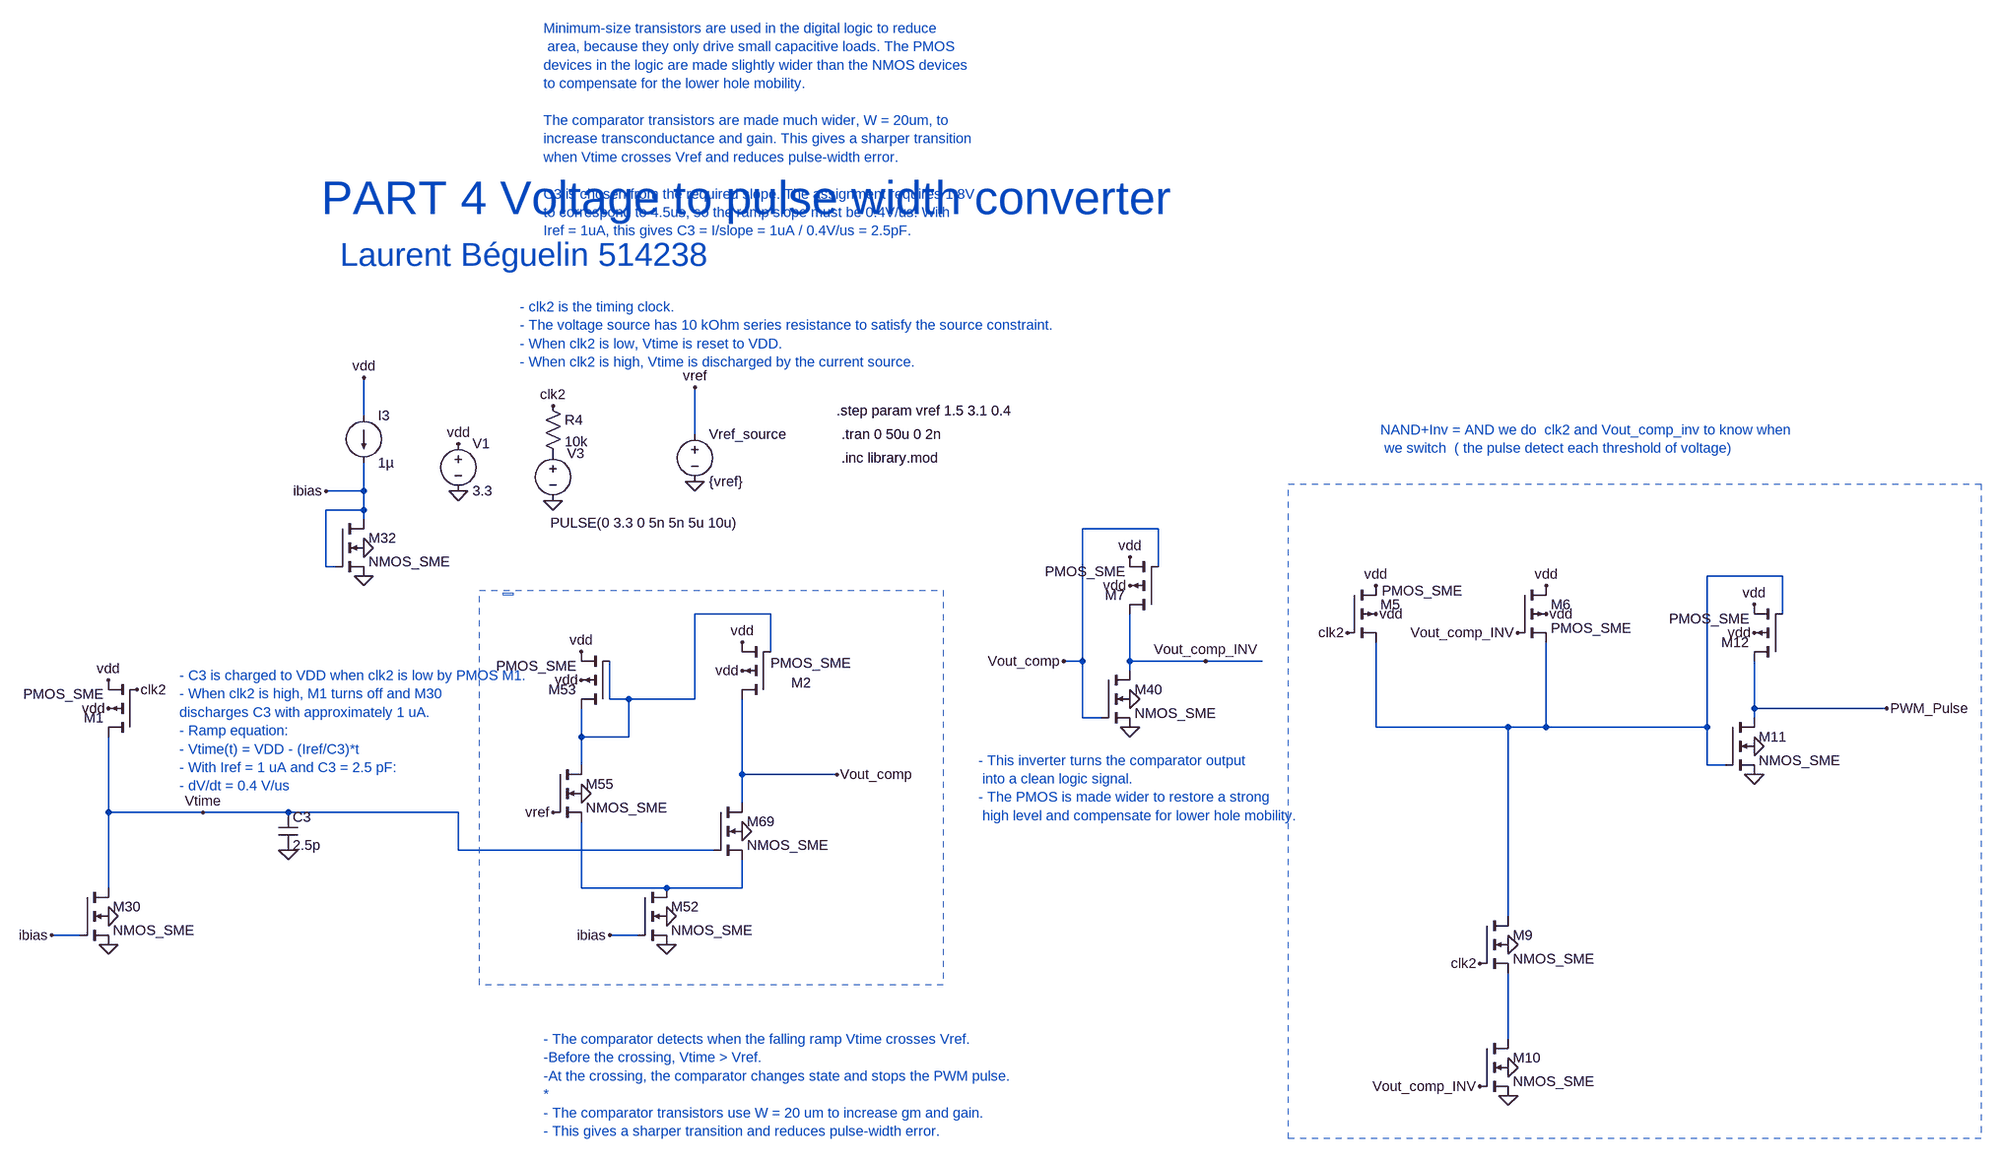
[diagram p0: schematic CMOS_Project_part4.asc]
CMOS_Project_part4.asc, the LTspice schematic file:
Version 4
SHEET 1 9192 1488
WIRE 5584 -624 5584 -688
WIRE 6144 -592 6144 -672
WIRE 5584 -496 5584 -544
WIRE 5584 -496 5520 -496
WIRE 5584 -464 5584 -496
WIRE 5584 -464 5520 -464
WIRE 5584 -448 5584 -464
WIRE 6928 -432 6800 -432
WIRE 5520 -368 5520 -464
WIRE 5536 -368 5520 -368
WIRE 6928 -368 6928 -432
WIRE 7984 -352 7856 -352
WIRE 6272 -288 6144 -288
WIRE 7984 -288 7984 -352
WIRE 6272 -224 6272 -288
WIRE 6800 -208 6800 -432
WIRE 6800 -208 6768 -208
WIRE 6880 -208 6880 -288
WIRE 7008 -208 6880 -208
WIRE 7104 -208 7008 -208
WIRE 6880 -192 6880 -208
WIRE 6000 -144 6000 -208
WIRE 6032 -144 6000 -144
WIRE 6144 -144 6144 -288
WIRE 6144 -144 6032 -144
WIRE 7936 -128 7936 -208
WIRE 8160 -128 7936 -128
WIRE 6800 -112 6800 -208
WIRE 6832 -112 6800 -112
WIRE 7936 -112 7936 -128
WIRE 7296 -96 7296 -240
WIRE 7520 -96 7296 -96
WIRE 7584 -96 7584 -240
WIRE 7584 -96 7520 -96
WIRE 7856 -96 7856 -352
WIRE 7856 -96 7584 -96
WIRE 5952 -80 5952 -128
WIRE 6032 -80 6032 -144
WIRE 6032 -80 5952 -80
WIRE 5952 -32 5952 -80
WIRE 7856 -32 7856 -96
WIRE 7888 -32 7856 -32
WIRE 6224 -16 6224 -144
WIRE 6384 -16 6224 -16
WIRE 6224 32 6224 -16
WIRE 5152 48 5152 -80
WIRE 5312 48 5152 48
WIRE 5456 48 5312 48
WIRE 5744 48 5456 48
WIRE 5744 112 5744 48
WIRE 6176 112 5744 112
WIRE 5152 176 5152 48
WIRE 5952 176 5952 64
WIRE 6096 176 5952 176
WIRE 6224 176 6224 128
WIRE 6224 176 6096 176
WIRE 7520 224 7520 -96
WIRE 5104 256 5056 256
WIRE 6048 256 6000 256
WIRE 7520 432 7520 320
FLAG 5744 -496 0
FLAG 5744 -576 vdd
FLAG 5904 -480 0
FLAG 5904 -640 clk2
FLAG 5312 48 Vtime
FLAG 5152 272 0
FLAG 5152 224 0
FLAG 5056 256 ibias
FLAG 5584 -352 0
FLAG 5584 -400 0
FLAG 5520 -496 ibias
FLAG 5584 -688 vdd
FLAG 6144 -512 0
FLAG 6144 -672 vref
FLAG 6880 -96 0
FLAG 6880 -144 0
FLAG 6096 272 0
FLAG 6096 224 0
FLAG 6000 256 ibias
FLAG 5952 -176 vdd
FLAG 5952 -224 vdd
FLAG 5952 16 0
FLAG 6224 80 0
FLAG 6384 -16 Vout_comp
FLAG 6768 -208 Vout_comp
FLAG 5456 112 0
FLAG 5152 -128 vdd
FLAG 5152 -176 vdd
FLAG 5200 -160 clk2
FLAG 6224 -192 vdd
FLAG 6224 -240 vdd
FLAG 5904 48 vref
FLAG 7008 -208 Vout_comp_INV
FLAG 6880 -384 vdd
FLAG 6880 -336 vdd
FLAG 7520 272 0
FLAG 7520 528 0
FLAG 7520 480 0
FLAG 7472 304 clk2
FLAG 7936 -16 0
FLAG 7936 -64 0
FLAG 7936 -304 vdd
FLAG 7936 -256 vdd
FLAG 8160 -128 PWM_Pulse
FLAG 7472 512 Vout_comp_INV
FLAG 7248 -256 clk2
FLAG 7536 -256 Vout_comp_INV
FLAG 7296 -288 vdd
FLAG 7584 -288 vdd
FLAG 7584 -336 vdd
FLAG 7296 -336 vdd
SYMBOL voltage 5744 -592 R0
WINDOW 123 0 0 Left 0
WINDOW 39 0 0 Left 0
SYMATTR InstName V1
SYMATTR Value 3.3
SYMBOL voltage 5904 -576 R0
WINDOW 123 0 0 Left 0
WINDOW 39 0 0 Left 0
WINDOW 3 -4 134 Left 2
SYMATTR Value PULSE(0 3.3 0 5n 5n 5u 10u)
SYMATTR InstName V3
SYMBOL Res 5888 -656 R0
SYMATTR InstName R4
SYMATTR Value 10k
SYMBOL Cap 5440 48 R0
SYMATTR InstName C3
SYMATTR Value 2.5p
SYMBOL nmos4 5104 176 R0
SYMATTR InstName M30
SYMATTR Value NMOS_SME
SYMATTR Value2 l=0.35u w=0.4u
SYMBOL current 5584 -624 R0
WINDOW 123 0 0 Left 0
WINDOW 39 0 0 Left 0
SYMATTR InstName I3
SYMATTR Value 1µ
SYMBOL nmos4 5536 -448 R0
SYMATTR InstName M32
SYMATTR Value NMOS_SME
SYMATTR Value2 l=0.35u w=0.4u
SYMBOL Voltage 6144 -608 R0
SYMATTR InstName Vref_source
SYMATTR Value {vref}
SYMATTR SpiceLine Rser=10k
SYMBOL nmos4 6832 -192 R0
SYMATTR InstName M40
SYMATTR Value NMOS_SME
SYMATTR Value2 l=0.35u w=0.4u
SYMBOL nmos4 6048 176 R0
SYMATTR InstName M52
SYMATTR Value NMOS_SME
SYMATTR Value2 l=0.35u w=0.4u
SYMBOL pmos4 6000 -128 R180
SYMATTR InstName M53
SYMATTR Value PMOS_SME
SYMATTR Value2 l=0.35u w=20u
SYMBOL nmos4 5904 -32 R0
SYMATTR InstName M55
SYMATTR Value NMOS_SME
SYMATTR Value2 l=0.35u w=20u
SYMBOL nmos4 6176 32 R0
SYMATTR InstName M69
SYMATTR Value NMOS_SME
SYMATTR Value2 l=0.35u w=20u
SYMBOL pmos4 5200 -80 R180
SYMATTR InstName M1
SYMATTR Value PMOS_SME
SYMATTR Value2 l=0.35u w=0.4u
SYMBOL pmos4 6272 -144 R180
WINDOW 0 -69 27 Left 2
WINDOW 3 -136 61 Left 2
SYMATTR InstName M2
SYMATTR Value PMOS_SME
SYMATTR Value2 l=0.35u w=20u
SYMBOL pmos4 6928 -288 R180
SYMATTR InstName M7
SYMATTR Value PMOS_SME
SYMATTR Value2 l=0.35u w=10u
SYMBOL nmos4 7472 224 R0
SYMATTR InstName M9
SYMATTR Value NMOS_SME
SYMATTR Value2 l=0.35u w=0.4u
SYMBOL nmos4 7472 432 R0
SYMATTR InstName M10
SYMATTR Value NMOS_SME
SYMATTR Value2 l=0.35u w=0.4u
SYMBOL nmos4 7888 -112 R0
SYMATTR InstName M11
SYMATTR Value NMOS_SME
SYMATTR Value2 l=0.35u w=0.4u
SYMBOL pmos4 7984 -208 R180
SYMATTR InstName M12
SYMATTR Value PMOS_SME
SYMATTR Value2 l=0.35u w=0.4u
SYMBOL pmos4 7248 -336 R0
WINDOW 3 58 9 Left 2
SYMATTR Value PMOS_SME
SYMATTR InstName M5
SYMATTR Value2 l=0.35u w=0.4u
SYMBOL pmos4 7536 -336 R0
SYMATTR InstName M6
SYMATTR Value PMOS_SME
SYMATTR Value2 l=0.35u w=0.4u
TEXT 6392 -552 Left 2 !.inc library.mod
TEXT 6392 -592 Left 2 !.tran 0 50u 0 2n
TEXT 5512 -992 Left 6 ;PART 4 Voltage to pulse width converter
TEXT 6384 -632 Left 2 !.step param vref 1.5 3.1 0.4
TEXT 7304 -600 Left 2 ;NAND+Inv = AND we do  clk2 and Vout_comp_inv to know when\n we switch  ( the pulse detect each threshold of voltage)
TEXT 5888 -1280 Left 2 ;Minimum-size transistors are used in the digital logic to reduce\n area, because they only drive small capacitive loads. The PMOS \ndevices in the logic are made slightly wider than the NMOS devices \nto compensate for the lower hole mobility.\n\nThe comparator transistors are made much wider, W = 20um, to \nincrease transconductance and gain. This gives a sharper transition \nwhen Vtime crosses Vref and reduces pulse-width error.\n\nC3 is chosen from the required slope. The assignment requires 1.8V \nto correspond to 4.5us, so the ramp slope must be 0.4V/us. With \nIref = 1uA, this gives C3 = I/slope = 1uA / 0.4V/us = 2.5pF.
TEXT 5544 -896 Left 5 ;Laurent Béguelin 514238
TEXT 5848 -808 Left 2 ;- clk2 is the timing clock.\n- The voltage source has 10 kOhm series resistance to satisfy the source constraint.\n- When clk2 is low, Vtime is reset to VDD.\n- When clk2 is high, Vtime is discharged by the current source.
TEXT 5272 -184 Left 2 ;- C3 is charged to VDD when clk2 is low by PMOS M1.\n- When clk2 is high, M1 turns off and M30 \ndischarges C3 with approximately 1 uA.\n- Ramp equation:\n- Vtime(t) = VDD - (Iref/C3)*t\n- With Iref = 1 uA and C3 = 2.5 pF:\n- dV/dt = 0.4 V/us
TEXT 5888 432 Left 2 ;- The comparator detects when the falling ramp Vtime crosses Vref.\n-Before the crossing, Vtime > Vref.\n-At the crossing, the comparator changes state and stops the PWM pulse.\n*\n- The comparator transistors use W = 20 um to increase gm and gain.\n- This gives a sharper transition and reduces pulse-width error.
TEXT 6624 -40 Left 2 ;- This inverter turns the comparator output\n into a clean logic signal.\n- The PMOS is made wider to restore a strong\n high level and compensate for lower hole mobility.
RECTANGLE Normal 7148 -508 8320 600 2
RECTANGLE Normal 5820 -324 5836 -320 2
RECTANGLE Normal 6564 340 5780 -328 2

The netlist it stands for:
* CMOS_Project_part4.asc
V1 vdd 0 3.3
V3 P001 0 PULSE(0 3.3 0 5n 5n 5u 10u)
R4 clk2 P001 10k
C3 Vtime 0 2.5p
M30 Vtime ibias 0 0 NMOS_SME l=0.35u w=0.4u
I3 vdd ibias 1µ
M32 ibias ibias 0 0 NMOS_SME l=0.35u w=0.4u
Vref_source vref 0 {vref} Rser=10k
M40 Vout_comp_INV Vout_comp 0 0 NMOS_SME l=0.35u w=0.4u
M52 N003 ibias 0 0 NMOS_SME l=0.35u w=0.4u
M53 N002 N002 vdd vdd PMOS_SME l=0.35u w=20u
M55 N002 vref N003 0 NMOS_SME l=0.35u w=20u
M69 Vout_comp Vtime N003 0 NMOS_SME l=0.35u w=20u
M1 Vtime clk2 vdd vdd PMOS_SME l=0.35u w=0.4u
M2 Vout_comp N002 vdd vdd PMOS_SME l=0.35u w=20u
M7 Vout_comp_INV Vout_comp vdd vdd PMOS_SME l=0.35u w=10u
M9 N001 clk2 N004 0 NMOS_SME l=0.35u w=0.4u
M10 N004 Vout_comp_INV 0 0 NMOS_SME l=0.35u w=0.4u
M11 PWM_Pulse N001 0 0 NMOS_SME l=0.35u w=0.4u
M12 PWM_Pulse N001 vdd vdd PMOS_SME l=0.35u w=0.4u
M5 vdd clk2 N001 vdd PMOS_SME l=0.35u w=0.4u
M6 vdd Vout_comp_INV N001 vdd PMOS_SME l=0.35u w=0.4u
.model NMOS NMOS
.model PMOS PMOS
.lib standard.mos
.inc library.mod
.tran 0 50u 0 2n
* PART 4 Voltage to pulse width converter
.step param vref 1.5 3.1 0.4
* NAND+Inv = AND we do  clk2 and Vout_comp_inv to know when
*  we switch  ( the pulse detect each threshold of voltage)
* Minimum-size transistors are used in the digital logic to reduce
*  area, because they only drive small capacitive loads. The PMOS
* devices in the logic are made slightly wider than the NMOS devices
* to compensate for the lower hole mobility.
* The comparator transistors are made much wider, W = 20um, to
* increase transconductance and gain. This gives a sharper transition
* when Vtime crosses Vref and reduces pulse-width error.
* C3 is chosen from the required slope. The assignment requires 1.8V
* to correspond to 4.5us, so the ramp slope must be 0.4V/us. With
* Iref = 1uA, this gives C3 = I/slope = 1uA / 0.4V/us = 2.5pF.
* Laurent Béguelin 514238
* - clk2 is the timing clock.
* - The voltage source has 10 kOhm series resistance to satisfy the source constraint.
* - When clk2 is low, Vtime is reset to VDD.
* - When clk2 is high, Vtime is discharged by the current source.
* - C3 is charged to VDD when clk2 is low by PMOS M1.
* - When clk2 is high, M1 turns off and M30
* discharges C3 with approximately 1 uA.
* - Ramp equation:
* - Vtime(t) = VDD - (Iref/C3)*t
* - With Iref = 1 uA and C3 = 2.5 pF:
* - dV/dt = 0.4 V/us
* - The comparator detects when the falling ramp Vtime crosses Vref.
* -Before the crossing, Vtime > Vref.
* -At the crossing, the comparator changes state and stops the PWM pulse.
* *
* - The comparator transistors use W = 20 um to increase gm and gain.
* - This gives a sharper transition and reduces pulse-width error.
* - This inverter turns the comparator output
*  into a clean logic signal.
* - The PMOS is made wider to restore a strong
*  high level and compensate for lower hole mobility.
.backanno
.end